# Altium schematic sheet Connectors.SchDoc
size A3; SheetNumber: 5; SheetTotal: 4
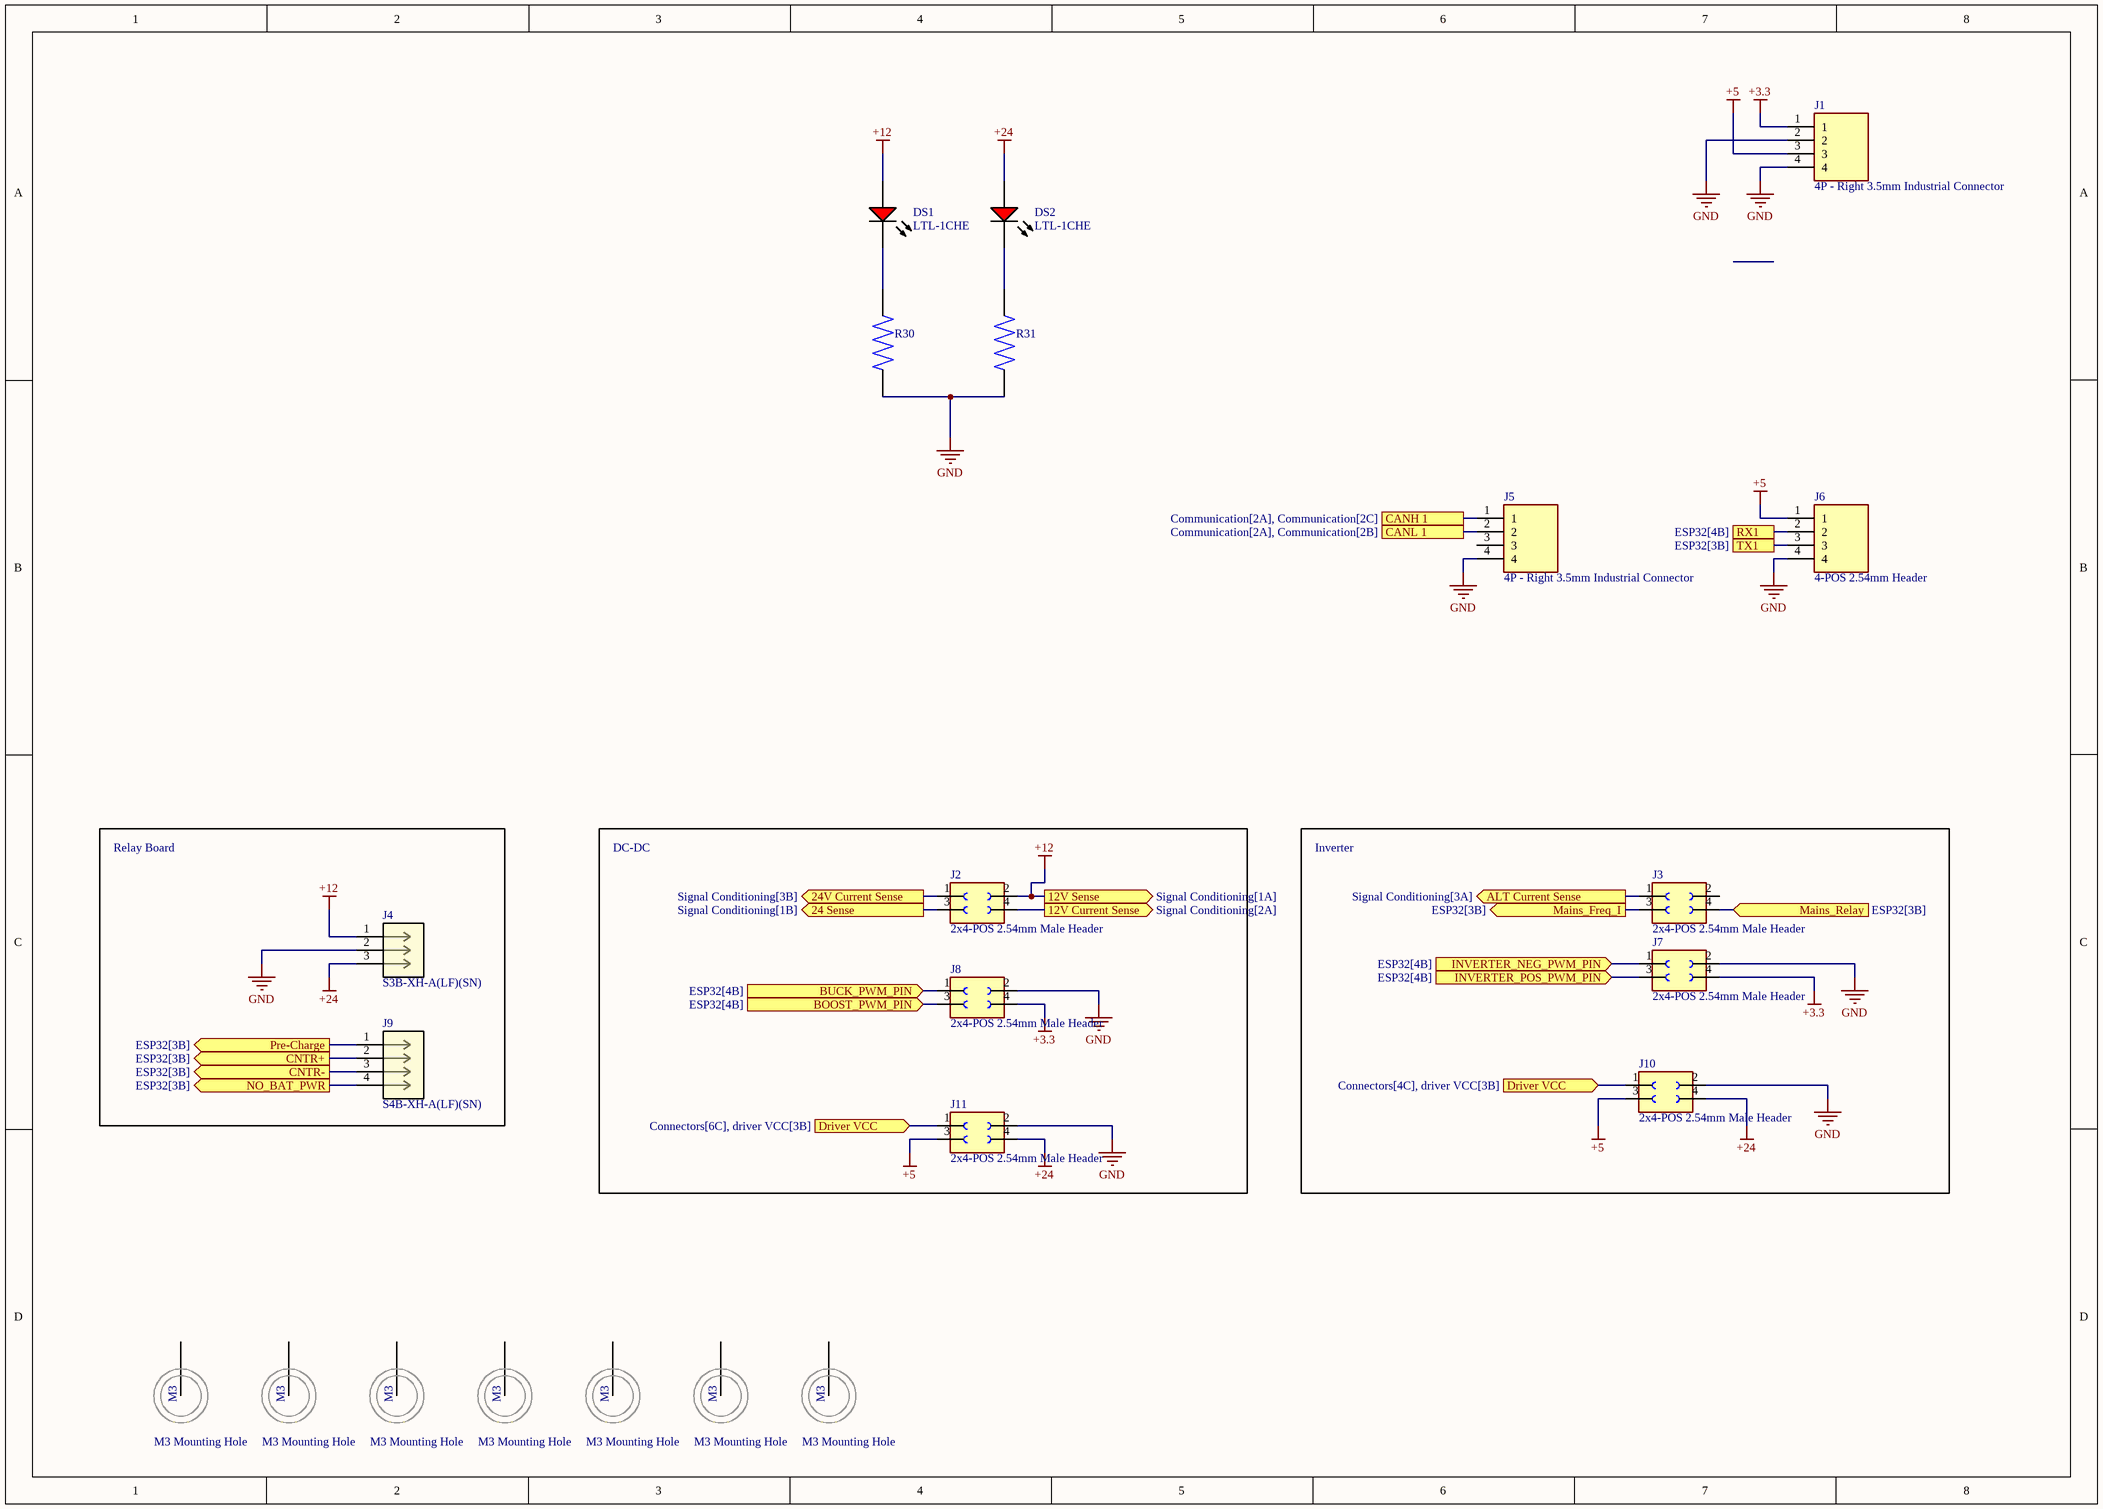
[diagram p0: Connectors.SchDoc]

## Parts
(Parts that share a designator on the sheet are numbered #1, #2 ... from top to bottom, then left to right.)
?#1  M3 Mounting Hole  [M3 - Mounting Hole]
?#2  M3 Mounting Hole  [M3 - Mounting Hole]
?#3  M3 Mounting Hole  [M3 - Mounting Hole]
?#4  M3 Mounting Hole  [M3 - Mounting Hole]
?#5  M3 Mounting Hole  [M3 - Mounting Hole]
?#6  M3 Mounting Hole  [M3 - Mounting Hole]
?#7  M3 Mounting Hole  [M3 - Mounting Hole]
DS1  LTL-1CHE  [LED3mm]
DS2  LTL-1CHE  [LED3mm]
J1  4P - Right 3.5mm Industrial Connector  [4P - Right 3.5mm Industrial Connector]
J2  2x4-POS 2.54mm Male Header  [2x4-POS 2.54mm Male Header]
J3  2x4-POS 2.54mm Male Header  [2x4-POS 2.54mm Male Header]
J4  S3B-XH-A(LF)(SN)  [3P JST XH2.54mm 90º]
J5  4P - Right 3.5mm Industrial Connector  [4P - Right 3.5mm Industrial Connector]
J6  4-POS 2.54mm Header  [4-POS 2.54mm Header]
J7  2x4-POS 2.54mm Male Header  [2x4-POS 2.54mm Male Header]
J8  2x4-POS 2.54mm Male Header  [2x4-POS 2.54mm Male Header]
J9  S4B-XH-A(LF)(SN)  [4P JST XH2.54mm 90º]
J10  2x4-POS 2.54mm Male Header  [2x4-POS 2.54mm Male Header]
J11  2x4-POS 2.54mm Male Header  [2x4-POS 2.54mm Male Header]
R30  Resistor_Through Hole  [Resistor_Through Hole]  (value not drawn)
R31  Resistor_Through Hole  [Resistor_Through Hole]  (value not drawn)

## Blocks framed on the sheet
Relay Board: J4 J9
DC-DC: J2 J8 J11
Inverter: J3 J7 J10

## Ports
12V Current Sense (out, see Signal Conditioning[2A]), 12V Sense (out, see Signal Conditioning[1A]), 24 Sense (out, see Signal Conditioning[1B]), 24V Current Sense (out, see Signal Conditioning[3B]), ALT Current Sense (out, see Signal Conditioning[3A]), BOOST_PWM_PIN (in, see ESP32[4B]), BUCK_PWM_PIN (in, see ESP32[4B]), CANH 1 (see Communication[2A], Communication[2C]), CANL 1 (see Communication[2A], Communication[2B]), CNTR+ (out, see ESP32[3B]), CNTR- (out, see ESP32[3B]), Driver VCC (in, see Connectors[4C], driver VCC[3B]), Driver VCC (in, see Connectors[6C], driver VCC[3B]), INVERTER_NEG_PWM_PIN (in, see ESP32[4B]), INVERTER_POS_PWM_PIN (in, see ESP32[4B]), Mains_Freq_I (out, see ESP32[3B]), Mains_Relay (in, see ESP32[3B]), NO_BAT_PWR (out, see ESP32[3B]), Pre-Charge (out, see ESP32[3B]), RX1 (see ESP32[4B]), TX1 (see ESP32[3B])

## Nets
+3.3: J1.1 J7.4 J8.4
+5: J1.3 J6.1 J10.3 J11.3
+12: DS1.1(A) J2.2 J4.1 ; port 12V Sense
+24: DS2.1(A) J4.3 J10.4 J11.4
GND: J1.2 J1.4 J4.2 J5.4 J6.4 J7.2 J8.2 J10.2 J11.2 R30.2 R31.2
12V Current Sense: J2.4 ; port 12V Current Sense
24 Sense: J2.3 ; port 24 Sense
24V Current Sense: J2.1 ; port 24V Current Sense
ALT Current Sense: J3.1 ; port ALT Current Sense
BOOST_PWM_PIN: J8.3 ; port BOOST_PWM_PIN
BUCK_PWM_PIN: J8.1 ; port BUCK_PWM_PIN
CANH 1: J5.1 ; port CANH 1
CANL 1: J5.2 ; port CANL 1
CNTR+: J9.2 ; port CNTR+
CNTR-: J9.3 ; port CNTR-
Driver VCC: J10.1 J11.1 ; port Driver VCC
INVERTER_NEG_PWM_PIN: J7.1 ; port INVERTER_NEG_PWM_PIN
INVERTER_POS_PWM_PIN: J7.3 ; port INVERTER_POS_PWM_PIN
Mains_Freq_I: J3.3 ; port Mains_Freq_I
Mains_Relay: J3.4 ; port Mains_Relay
NO_BAT_PWR: J9.4 ; port NO_BAT_PWR
Pre-Charge: J9.1 ; port Pre-Charge
RX1: J6.2 ; port RX1
TX1: J6.3 ; port TX1
NetDS1_2: DS1.2(K) R30.1
NetDS2_2: DS2.2(K) R31.1

Not connected (* = marked no-connect by the designer): ?#1 1(M3); ?#2 1(M3); ?#3 1(M3); ?#4 1(M3); ?#5 1(M3); ?#6 1(M3); ?#7 1(M3); J3 2(4); J5 3

## Library data of the parts
DS1 DS2 = RED_LED 3mm: Radial LED, 12.6 mcd, 20 mA, 2 V, -55 to 100 degC, 2-Pin THD, RoHS, Bulk; Shielding: Unshielded; Resistance: 0.045 Ohm; Current Rating: 3.6 A; Tolerance: 20%; PackageReference: LTL-1CHE; PackageDescription: 2-Pin Through Hole Device, Dia 3.8 mm, Pitch 2.54 mm; Case\Package: Radial; Length: 0.97 inch; Width: 0.62 inch; Height: 1.1 inch; Radiation Hardening: No; Lead Pitch: 11.44 mm; ComponentLink1URL: http://www.us.liteon.com/; ComponentLink1Description: Manufacturer URL; RoHSCompliant: true; Packaging: Tray; Mount: Through Hole; Min Operating Temperature: -40 degC; Max Operating Temperature: 130 degC; ComponentLink2URL: https://datasheet.ciiva.com/15117/getdatasheetpartid-187746-15117985.pdf; Package Quantity: 55; ComponentLink2Description: Datasheet; DatasheetVersion: Dec-03
J1 J5 = 4P - Right 3.5mm Industrial Connector: MP: 5-146290-4; Package: None; Price: None; Value: *; Availability: Unavailable
J2 J3 J7 J8 J10 J11 = 2x4-POS 2.54mm Male Header: MF: WÃ¼rth Elektronik; MP: 613004243121; SnapEDA_Link: https://www.snapeda.com/parts/613004243121/W%C3%BCrth%20Elektronik/view-part/1737074/?ref=snap; Check_prices: https://www.snapeda.com/parts/613004243121/W%C3%BCrth%20Elektronik/view-part/1737074/?ref=eda; Availability: Unavailable; Value: *; Price: None; Package: None
J4 = 3P JST XH2.54mm 90º: No Description Available; Mfr_Name: JST; Copyright: Copyright (C) 2024 Ultra Librarian. All rights reserved.; Manufacturer_Part_Number: S3B-XH-A(LF)(SN); RefDes: RefDes; Type: DEV
J6 = 4-POS 2.54mm Header: MP: 5-146290-4; Package: None; Price: None; Value: *; Availability: Unavailable
J9 = 4P JST XH2.54mm 90º: No Description Available; Mfr_Name: JST; Copyright: Copyright (C) 2024 Ultra Librarian. All rights reserved.; Manufacturer_Part_Number: S4B-XH-A(LF)(SN); RefDes: RefDes; Type: DEV
R30 R31 = Resistor_Through Hole: 1.02 Ohms Â±1% 0.25W, 1/4W Through Hole Resistor Axial Metal Film; MP: MFR-25FTE52-1R; MF: Yageo; Availability: Warning; Value: *; Check_prices: https://www.snapeda.com/parts/MFR-25FTE52-1R/Yageo/view-part/4629919/?ref=eda; Package: Axial Yageo; Price: None; SnapEDA_Link: https://www.snapeda.com/parts/MFR-25FTE52-1R/Yageo/view-part/4629919/?ref=snap; Purchase-URL: https://pricing.snapeda.com/search/part/MFR-25FTE52-1R/?ref=eda